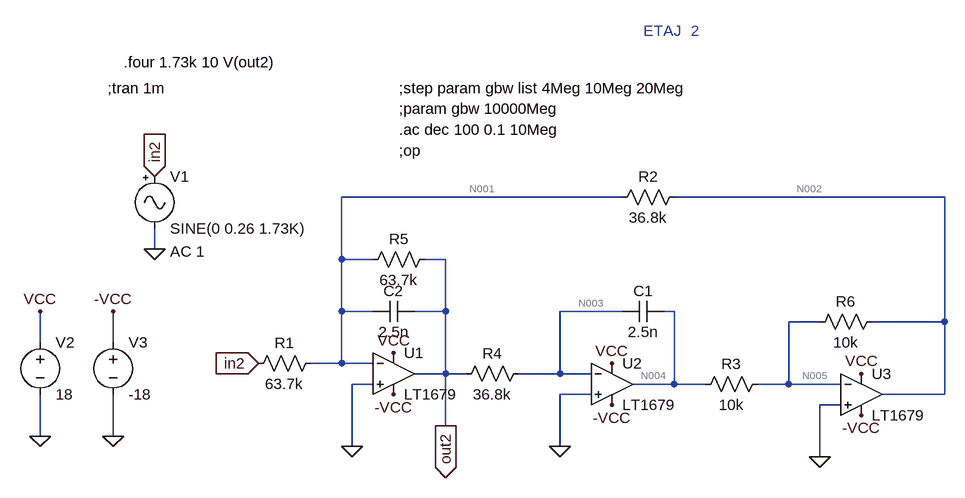
[diagram p0: schematic Etaj2.asc]
* Etaj2.asc
R1 N001 in2 63.7k
R2 N002 N001 36.8k
R3 N005 N004 10k
R4 N003 out2 36.8k
R5 out2 N001 63.7k
R6 N002 N005 10k
C1 N004 N003 2.5n
C2 out2 N001 2.5n
* U1: LT1679 (symbol OpAmps\LT1679 not available, pins judged from their places): In+=0 In-=N001 V+=VCC V-=-VCC OUT=out2
* U2: LT1679 (symbol OpAmps\LT1679 not available, pins judged from their places): In+=0 In-=N003 V+=VCC V-=-VCC OUT=N004
* U3: LT1679 (symbol OpAmps\LT1679 not available, pins judged from their places): In+=0 In-=N005 V+=VCC V-=-VCC OUT=N002
V1 in2 0 SINE(0 0.26 1.73K) AC 1
V2 VCC 0 18
V3 -VCC 0 -18
* ETAJ  2
;param gbw 10000Meg
;step param gbw list 4Meg 10Meg 20Meg
.ac dec 100 0.1 10Meg
;op
.four 1.73k 10 V(out2)
;tran 1m
.backanno
.end

* Results of the author's LTspice run, read from the files saved beside the schematic
* Operating Point, zero values left out:
*   V(n001) = 2.403 µV
*   V(n002) = 6.093 µV
*   V(n005) = 2.403 µV
*   V(n004) = 193.7 nV
*   V(n003) = 2.403 µV
*   V(out2) = 7.855 µV
*   V(vcc) = 18 V
*   V(-vcc) = -18 V
*   I(R6) = 369.1 pA
*   I(R5) = 85.6 pA
*   I(R4) = -148.2 pA
*   I(R3) = 220.9 pA
*   I(R2) = 100.3 pA
*   I(R1) = 37.72 pA
*   I(V3) = 7.693 mA
*   I(V2) = -7.693 mA
*   I(V1) = 37.72 pA
*   Ix(u1:1) = 148.2 pA
*   Ix(u1:2) = 148.2 pA
*   Ix(u1:3) = -233.8 pA
*   Ix(u1:4) = 2.564 mA
*   Ix(u1:5) = -2.564 mA
*   Ix(u2:1) = 148.2 pA
*   Ix(u2:2) = 148.2 pA
*   Ix(u2:3) = 220.9 pA
*   Ix(u2:4) = 2.564 mA
*   Ix(u2:5) = -2.564 mA
*   Ix(u3:1) = 148.2 pA
*   Ix(u3:2) = 148.2 pA
*   Ix(u3:3) = -469.3 pA
*   Ix(u3:4) = 2.564 mA
*   Ix(u3:5) = -2.564 mA
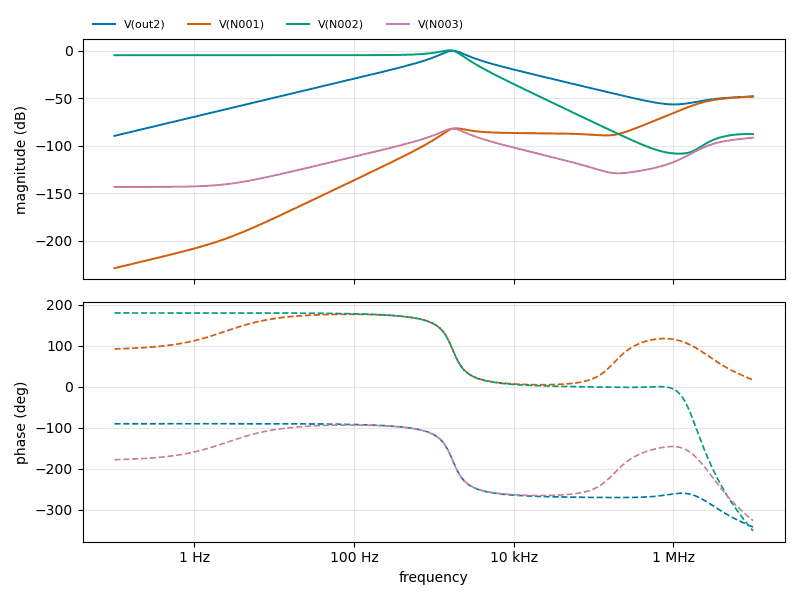
[diagram p1: AC Analysis of Etaj2.asc, plotted from the saved traces]
* AC Analysis, 1 run:
*   V(out2): -89.53 dB at 100 mHz, -48.02 dB at 10 MHz, peak 0.00 dB at 1.738 kHz, 3 dB below the peak at 1.301 kHz and 2.3 kHz
*   V(N001): -228.60 dB at 100 mHz, -48.10 dB at 10 MHz, peak -48.10 dB at 10 MHz, 3 dB below the peak at 3.61 MHz
*   V(N002): -4.77 dB at 100 mHz, -87.69 dB at 10 MHz, peak 0.38 dB at 1.585 kHz, 3 dB below the peak at 916 Hz and 2.036 kHz
*   V(N003): -143.22 dB at 100 mHz, -91.37 dB at 10 MHz, peak -81.93 dB at 1.738 kHz, 3 dB below the peak at 1.301 kHz and 2.3 kHz